# EasyEDA Pro project Module32Switches_TH.epro

# Schematic Main
Board Name: Module32Switches; Create Date: 2025-06-27; Page Name: P1; Project Name: Module32Switches_TH; Schematic Name: Main; Update Date: 2025-06-27; Company: EasyEDA.com; Page Size: A4; Version: V1.0
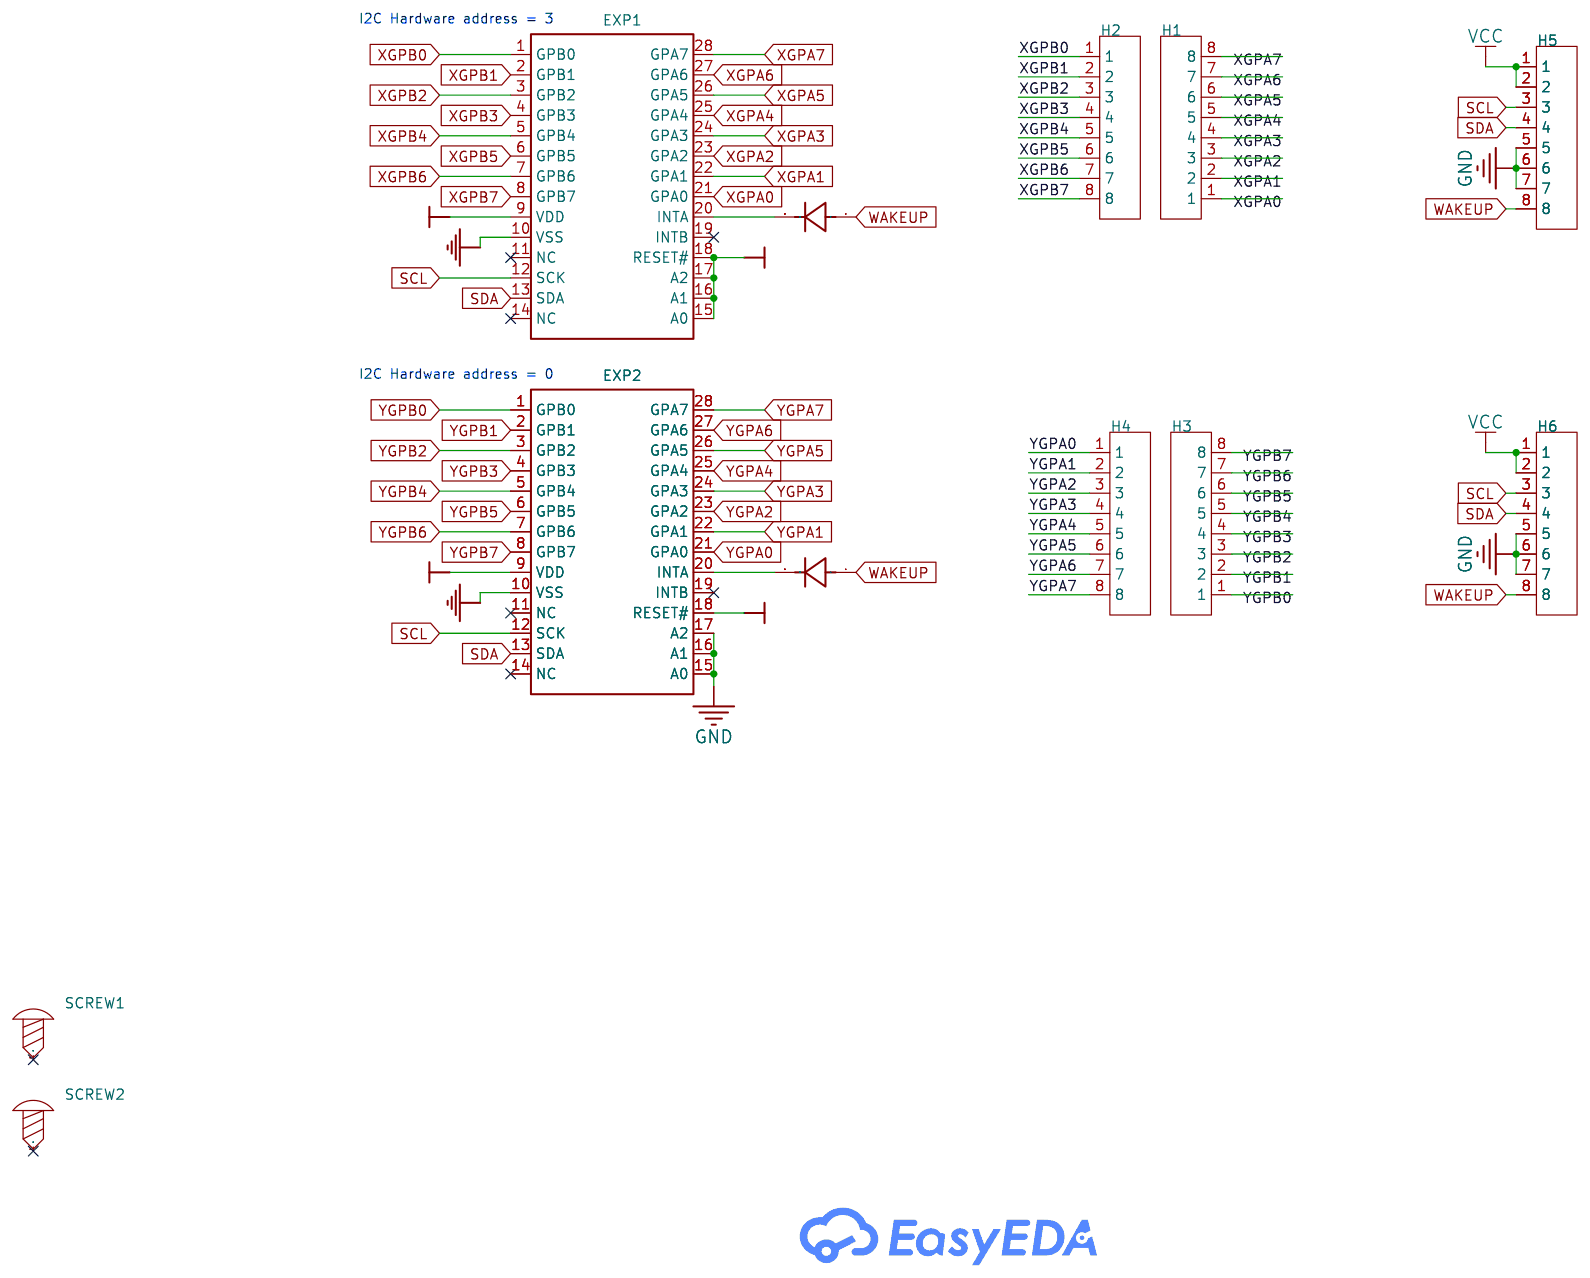
[diagram p0: schematic sheet]

## Parts
D1  1N4148_C18195411  [DO-35_BD2.2-L4.0-D0.50_1N4148]  (no BOM)
D2  1N4148_C18195411  [DO-35_BD2.2-L4.0-D0.50_1N4148]  (no BOM)
EXP1  MCP23017-E/SP  [DIP-28_L34.6-W7.3-P2.54-LS10.2-BL]  (no BOM)
EXP2  MCP23017-E/SP  [DIP-28_L34.6-W7.3-P2.54-LS10.2-BL]  (no BOM)
H1  PZ254R-11-08P  [HDR-TH_8P-P2.54-H-M-W10.4]  (no BOM)
H2  PZ254R-11-08P  [HDR-TH_8P-P2.54-H-M-W10.4]  (no BOM)
H3  PZ254R-11-08P  [HDR-TH_8P-P2.54-H-M-W10.4]  (no BOM)
H4  PZ254R-11-08P  [HDR-TH_8P-P2.54-H-M-W10.4]  (no BOM)
H5  PZ254R-11-08P  [HDR-TH_8P-P2.54-H-M-W10.4]  (no BOM)
H6  PZ254R-11-08P  [HDR-TH_8P-P2.54-H-M-W10.4]  (no BOM)
SCREW1  -  [Screw-Hole-M2]  (no BOM)
SCREW2  -  [Screw-Hole-M2]  (no BOM)

## Library data of the parts
D1 D2 = 1N4148_C18195411: Supplier: LCSC; Supplier Part: C18195411; Manufacturer: LJ(朗捷); Manufacturer Part: 1N4148; JLCPCB Part Class: Extended Part; Contributor: lcsc; spicePre: D
EXP1 EXP2 = MCP23017-E/SP: Supplier: LCSC; Supplier Part: C647352; Manufacturer: MICROCHIP(美国微芯); JLCPCB Part Class: Extended Part; Contributor: LCSC; spicePre: U
H1-H6 = PZ254R-11-08P: Pin Structure:1x8P Pitch:2.54mm Row Spacing:- Circluar Pins/Square Pins:Policy Mounting Type:Right-Angle Number of Rows:Single Row Number of Pins:8P Current Rating:- Voltage Rating (Max):- Length of Mating Pin:6mm Insulation Height:2.5mm Contact Material:; LCSC Part Name: 1x8P 间距:2.54mm 方针 弯插; Supplier Part: C492416; Manufacturer: XFCN(兴飞); Supplier Footprint: 弯插,P=2.54mm; JLCPCB Part Class: Extended Part; Datasheet: https://atta.szlcsc.com/upload/public/pdf/source/20200309/C492416_50F53578DC639C00894E1D796EC334D3.pdf; Supplier: LCSC; Pin Structure: 1x8P; Pitch: 2.54mm; Circluar Pins/Square Pins: Policy; Mounting Type: Right-Angle; Number of Rows: Single Row; Number of Pins: 8P; Length of Mating Pin: 6mm; Insulation Height: 2.5mm; Contact Material: Brass; Operating Temperature: -40℃~+105℃; Color: Black
SCREW1 SCREW2 = Screw-Hole-M2: Supplier Footprint: 插件

## Nets
GND: EXP1.10(VSS) EXP2.10(VSS) EXP2.15(A0) EXP2.16(A1) EXP2.17(A2) H5.5 H5.6 H5.7 H6.5 H6.6 H6.7
VCC: EXP1.9(VDD) EXP1.15(A0) EXP1.16(A1) EXP1.17(A2) EXP1.18(RESET#) EXP2.9(VDD) EXP2.18(RESET#) H5.1 H5.2 H6.1 H6.2
SCL: EXP1.12(SCK) EXP2.12(SCK) H5.3 H6.3
SDA: EXP1.13(SDA) EXP2.13(SDA) H5.4 H6.4
WAKEUP: D1.1(A) D2.1(A) H5.8 H6.8
XGPA0: EXP1.21(GPA0) H1.1
XGPA1: EXP1.22(GPA1) H1.2
XGPA2: EXP1.23(GPA2) H1.3
XGPA3: EXP1.24(GPA3) H1.4
XGPA4: EXP1.25(GPA4) H1.5
XGPA5: EXP1.26(GPA5) H1.6
XGPA6: EXP1.27(GPA6) H1.7
XGPA7: EXP1.28(GPA7) H1.8
XGPB0: EXP1.1(GPB0) H2.1
XGPB1: EXP1.2(GPB1) H2.2
XGPB2: EXP1.3(GPB2) H2.3
XGPB3: EXP1.4(GPB3) H2.4
XGPB4: EXP1.5(GPB4) H2.5
XGPB5: EXP1.6(GPB5) H2.6
XGPB6: EXP1.7(GPB6) H2.7
XGPB7: EXP1.8(GPB7) H2.8
YGPA0: EXP2.21(GPA0) H4.1
YGPA1: EXP2.22(GPA1) H4.2
YGPA2: EXP2.23(GPA2) H4.3
YGPA3: EXP2.24(GPA3) H4.4
YGPA4: EXP2.25(GPA4) H4.5
YGPA5: EXP2.26(GPA5) H4.6
YGPA6: EXP2.27(GPA6) H4.7
YGPA7: EXP2.28(GPA7) H4.8
YGPB0: EXP2.1(GPB0) H3.1
YGPB1: EXP2.2(GPB1) H3.2
YGPB2: EXP2.3(GPB2) H3.3
YGPB3: EXP2.4(GPB3) H3.4
YGPB4: EXP2.5(GPB4) H3.5
YGPB5: EXP2.6(GPB5) H3.6
YGPB6: EXP2.7(GPB6) H3.7
YGPB7: EXP2.8(GPB7) H3.8
$1N406: D1.2(C) EXP1.20(INTA)
$1N912: D2.2(C) EXP2.20(INTA)

Not connected (* = marked no-connect by the designer): EXP1 11(NC)* 14(NC)* 19(INTB)*; EXP2 11(NC)* 14(NC)* 19(INTB)*; SCREW1 1*; SCREW2 1*

## Notes on the sheet
- I2C Hardware address = 3
- I2C Hardware address = 0

# Board PCB
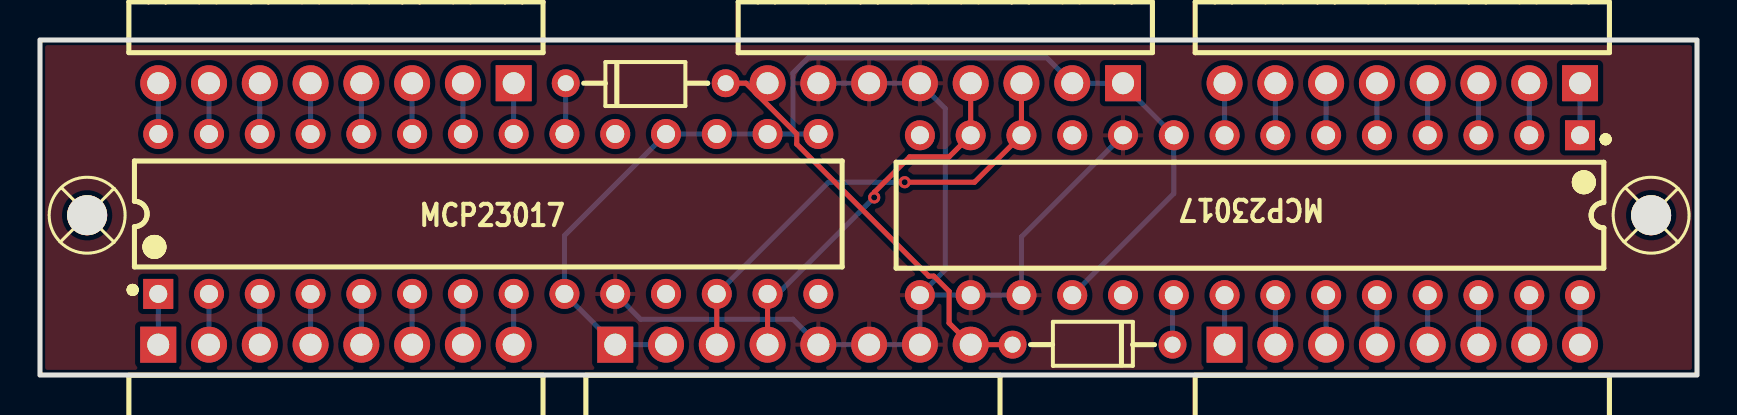
[diagram p1: board, top side]
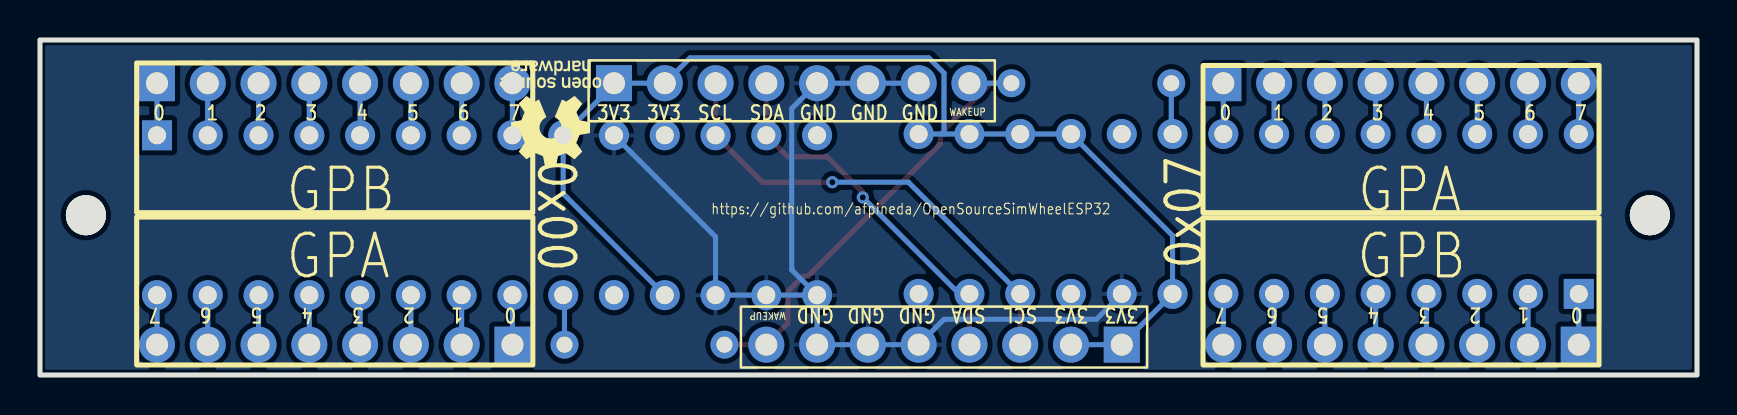
[diagram p2: board, bottom side, seen from below]

Outline 82.89 x 16.76 mm; copper layers: Top Layer, Bottom Layer. Coordinates in mm from the lower left corner of the outline.
Outline path: rectangle 0,16.76 82.89,0
Stack: Top Layer 0.035mm / Dielectric1 1.51mm FR4 er 4.5 / Bottom Layer 0.035mm

## Design rules (mm)
template: JLCPCB Capability(Two Layers Board)
spacing copperThickness1oz (default): track to track 0.102, other pairs 0.152 to 0.3
spacing copperThickness2oz: track to track 0.203, other pairs 0.152 to 0.3
track width copperThickness1oz (default): min 0.127, default 0.254, max 2.54
track width copperThickness2oz: min 0.203, default 0.254, max 2.54
differential pair differentialPair (default): width min 0.127, default 0.254, max 2.54; gap min 0.152, default 0.152
via viaSize (default): diameter min 0.5, default 0.61, max 10; hole min 0.3, default 0.305, max 6.3

## Placement (name value [footprint] x y rotation side)
D1  1N4148_C18195411  [DO-35_BD2.2-L4.0-D0.50_1N4148]  30.3 14.6 180 top
D2  1N4148_C18195411  [DO-35_BD2.2-L4.0-D0.50_1N4148]  52.65 1.52 0 top
EXP1  MCP23017-E/SP  [DIP-28_L34.6-W7.3-P2.54-LS10.2-BL]  22.43 8.06 0 top
EXP2  MCP23017-E/SP  [DIP-28_L34.6-W7.3-P2.54-LS10.2-BL]  60.53 8 180 top
H1  PZ254R-11-08P  [HDR-TH_8P-P2.54-H-M-W10.4]  14.81 14.6 180 top
H2  PZ254R-11-08P  [HDR-TH_8P-P2.54-H-M-W10.4]  14.81 1.52 0 top
H3  PZ254R-11-08P  [HDR-TH_8P-P2.54-H-M-W10.4]  68.14 14.6 180 top
H4  PZ254R-11-08P  [HDR-TH_8P-P2.54-H-M-W10.4]  68.14 1.52 0 top
H5  PZ254R-11-08P  [HDR-TH_8P-P2.54-H-M-W10.4]  37.67 1.52 0 top
H6  PZ254R-11-08P  [HDR-TH_8P-P2.54-H-M-W10.4]  45.29 14.6 180 top
SCREW1  -  [Screw-Hole-M2]  2.36 8 0 top
SCREW2  -  [Screw-Hole-M2]  80.59 8 0 top

## Footprints (pads in the part's own frame, mm; a bottom-side part is the same pattern mirrored in y, then rotated)
DIP-28_L34.6-W7.3-P2.54-LS10.2-BL
  rect 1.5x1.5 hole 0.9: 1(-16.51,-4)
  round 1.5 hole 0.9: 2(-13.97,-4) 3(-11.43,-4) 4(-8.89,-4) 5(-6.35,-4) 6(-3.81,-4) 7(-1.27,-4) 8(1.27,-4) 9(3.81,-4) 10(6.35,-4) 11(8.89,-4) 12(11.43,-4) 13(13.97,-4) 14(16.51,-4) 15(16.51,4) 16(13.97,4) 17(11.43,4) 18(8.89,4) 19(6.35,4) 20(3.81,4) 21(1.27,4) 22(-1.27,4) 23(-3.81,4) 24(-6.35,4) 25(-8.89,4) 26(-11.43,4) 27(-13.97,4) 28(-16.51,4)
DO-35_BD2.2-L4.0-D0.50_1N4148
  round 1.4 hole 0.8: 1(-4,0) 2(4,0)
HDR-TH_8P-P2.54-H-M-W10.4
  rect 1.8x1.8 hole 1.1: 1(-8.89,0)
  round 1.8 hole 1.1: 2(-6.35,0) 3(-3.81,0) 4(-1.27,0) 5(1.27,0) 6(3.81,0) 7(6.35,0) 8(8.89,0)
Screw-Hole-M2
  round 2 hole 2: 1(0,0)

## Nets
As in the schematic.

Pads without a net: EXP1 11 14 19; EXP2 11 14 19; SCREW1 1; SCREW2 1

## Via types
v1: diameter 0.61, hole 0.305, Top Layer to Bottom Layer, 2 vias

## Routing (per net, layer and track width the routed paths; a pad name or vN(x,y) marks a point on that pad's centre or on a via; arc(x,y) is an arc through that point)
GND: length 50.7
  Bottom Layer w0.254: EXP2.15 45.29,5.27 45.29,13.33 H6.5 H6.6 H6.7 ; EXP2.15 EXP2.16 EXP2.17 49.1,6.92 EXP2.10 ; EXP2.15 H5.7 H5.6 H5.5 37.67,2.79 30.05,2.79 EXP1.10
VCC: length 58
  Bottom Layer w0.254: 37.67,12.06 37.67,15.11 38.43,15.87 50.37,15.87 H6.2 H6.1 54.17,14.54 EXP2.9 56.72,9.08 EXP2.18 ; 37.67,12.06 EXP1.15 ; 37.67,12.06 EXP1.16 EXP1.17 EXP1.18 26.23,6.98 EXP1.9 H5.1 H5.2
SCL: length 23.7
  Top Layer w0.254: H6.3 EXP2.12 46.75,9.65 v1(43.25,9.65) ; EXP1.12 H5.3
  Bottom Layer w0.254: EXP1.12 39.44,9.65 v1(43.25,9.65)
SDA: length 18.7
  Top Layer w0.254: H6.4 EXP2.13 45.48,10.92 43.51,10.92 41.73,9.14 v1(41.73,8.89) ; EXP1.13 H5.4
  Bottom Layer w0.254: EXP1.13 36.9,4.06 v1(41.73,8.89)
WAKEUP: length 23.1
  Top Layer w0.254: D2.1 H5.8 45.48,2.6 45.48,4.19 44.71,4.95 44.46,4.95 37.86,11.55 37.86,12.06 35.32,14.6 D1.1
  Bottom Layer w0.254: D1.1 H6.8
XGPA0: length 2.5
  Bottom Layer w0.254: EXP1.21 H1.1
XGPA1: length 2.5
  Bottom Layer w0.254: EXP1.22 H1.2
XGPA2: length 2.5
  Bottom Layer w0.254: EXP1.23 H1.3
XGPA3: length 2.5
  Bottom Layer w0.254: EXP1.24 H1.4
XGPA4: length 2.5
  Bottom Layer w0.254: EXP1.25 H1.5
XGPA5: length 2.5
  Bottom Layer w0.254: EXP1.26 H1.6
XGPA6: length 2.5
  Bottom Layer w0.254: EXP1.27 H1.7
XGPA7: length 2.5
  Bottom Layer w0.254: EXP1.28 H1.8
XGPB0: length 2.5
  Bottom Layer w0.254: EXP1.1 H2.1
XGPB1: length 2.5
  Bottom Layer w0.254: EXP1.2 H2.2
XGPB2: length 2.5
  Bottom Layer w0.254: EXP1.3 H2.3
XGPB3: length 2.5
  Bottom Layer w0.254: EXP1.4 H2.4
XGPB4: length 2.5
  Bottom Layer w0.254: EXP1.5 H2.5
XGPB5: length 2.5
  Bottom Layer w0.254: EXP1.6 H2.6
XGPB6: length 2.5
  Bottom Layer w0.254: EXP1.7 H2.7
XGPB7: length 2.5
  Bottom Layer w0.254: EXP1.8 H2.8
YGPA0: length 2.5
  Bottom Layer w0.254: EXP2.21 H4.1
YGPA1: length 2.5
  Bottom Layer w0.254: EXP2.22 H4.2
YGPA2: length 2.5
  Bottom Layer w0.254: EXP2.23 H4.3
YGPA3: length 2.5
  Bottom Layer w0.254: EXP2.24 H4.4
YGPA4: length 2.5
  Bottom Layer w0.254: EXP2.25 H4.5
YGPA5: length 2.5
  Bottom Layer w0.254: EXP2.26 H4.6
YGPA6: length 2.5
  Bottom Layer w0.254: EXP2.27 H4.7
YGPA7: length 2.5
  Bottom Layer w0.254: EXP2.28 H4.8
YGPB0: length 2.6
  Bottom Layer w0.254: EXP2.1 H3.1
YGPB1: length 2.6
  Bottom Layer w0.254: EXP2.2 H3.2
YGPB2: length 2.6
  Bottom Layer w0.254: EXP2.3 H3.3
YGPB3: length 2.6
  Bottom Layer w0.254: EXP2.4 H3.4
YGPB4: length 2.6
  Bottom Layer w0.254: EXP2.5 H3.5
YGPB5: length 2.6
  Bottom Layer w0.254: EXP2.6 H3.6
YGPB6: length 2.6
  Bottom Layer w0.254: EXP2.7 H3.7
YGPB7: length 2.6
  Bottom Layer w0.254: EXP2.8 H3.8
$1N406: length 2.6
  Bottom Layer w0.254: EXP1.20 26.3,12.12 D1.2
$1N912: length 2.5
  Bottom Layer w0.254: D2.2 56.65,3.93 EXP2.20

## Copper pours and planes (outline as drawn; the poured copper is in the pictures)
GND on Top Layer: 0,16.76 82.89,16.76 82.89,0 0,0
GND on Bottom Layer: 0,16.76 82.89,16.76 82.89,0 0,0

## Text on the board
Bottom Silkscreen Layer: WAKEUP | https://github.com/afpineda/OpenSourceSimWheelESP32 | 7 | 6 | 5 | 4 | 3 | 2 | 1 | 0 | 3V3 | SCL | SDA | GND | 0x07 | 0x00 | GPA | GPB
Top Silkscreen Layer: MCP23017
